# Altium schematic sheet FPGA.SchDoc
size A2; Date: Date; CompanyName: HESSO; Engineer: Name; Address1: Route du Rawyl 47; Address2: 1950 Sion; Address3: Switzerland; ProjectName: Project Name
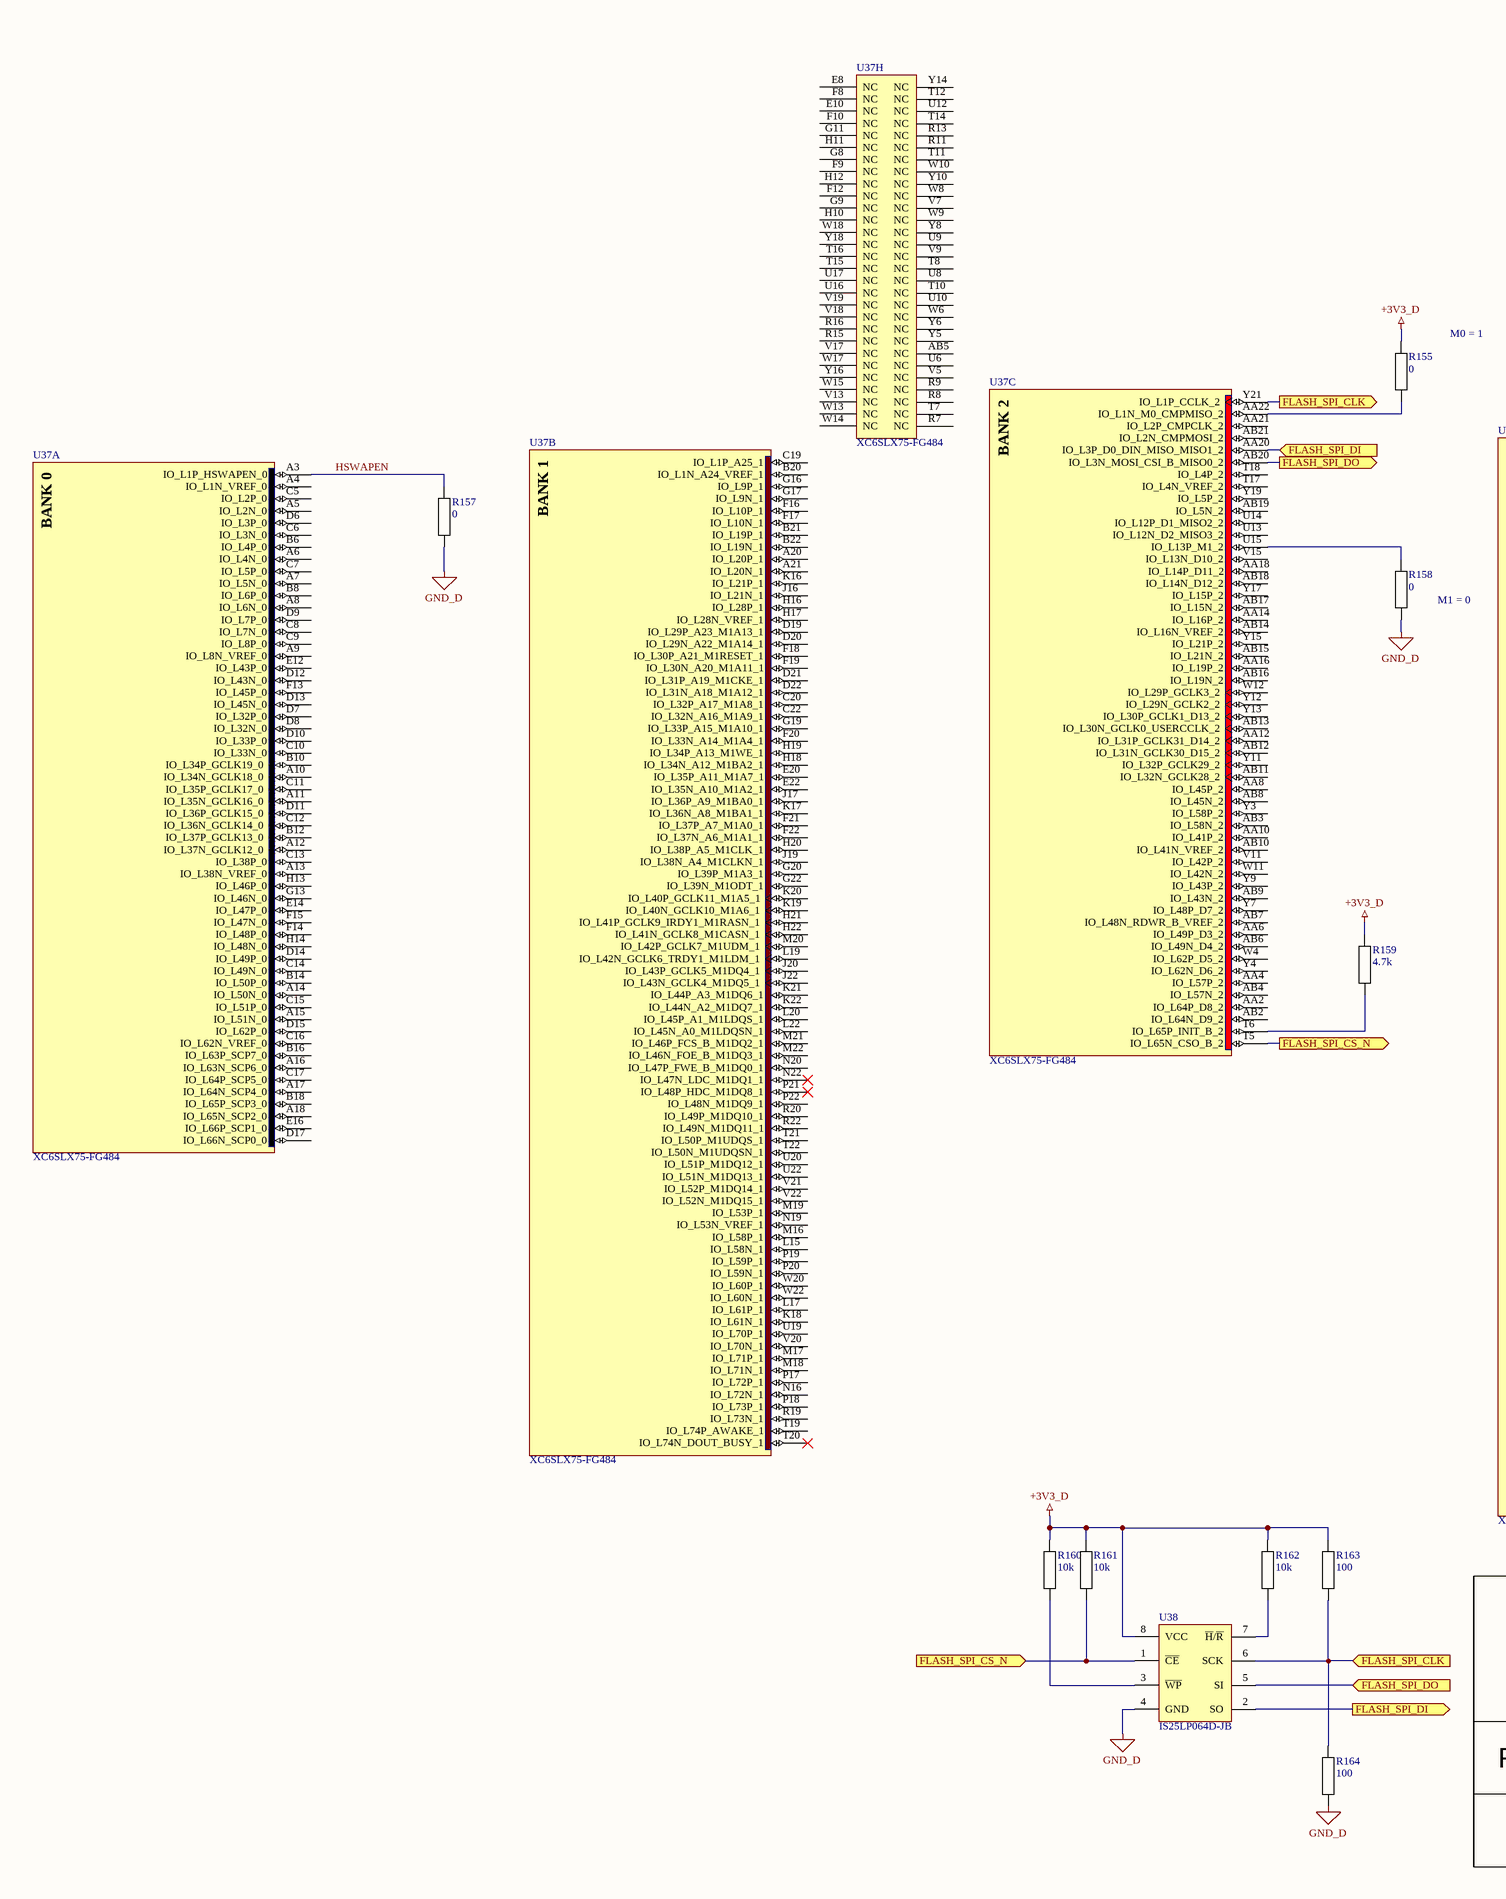
[diagram p0: FPGA.SchDoc, left]
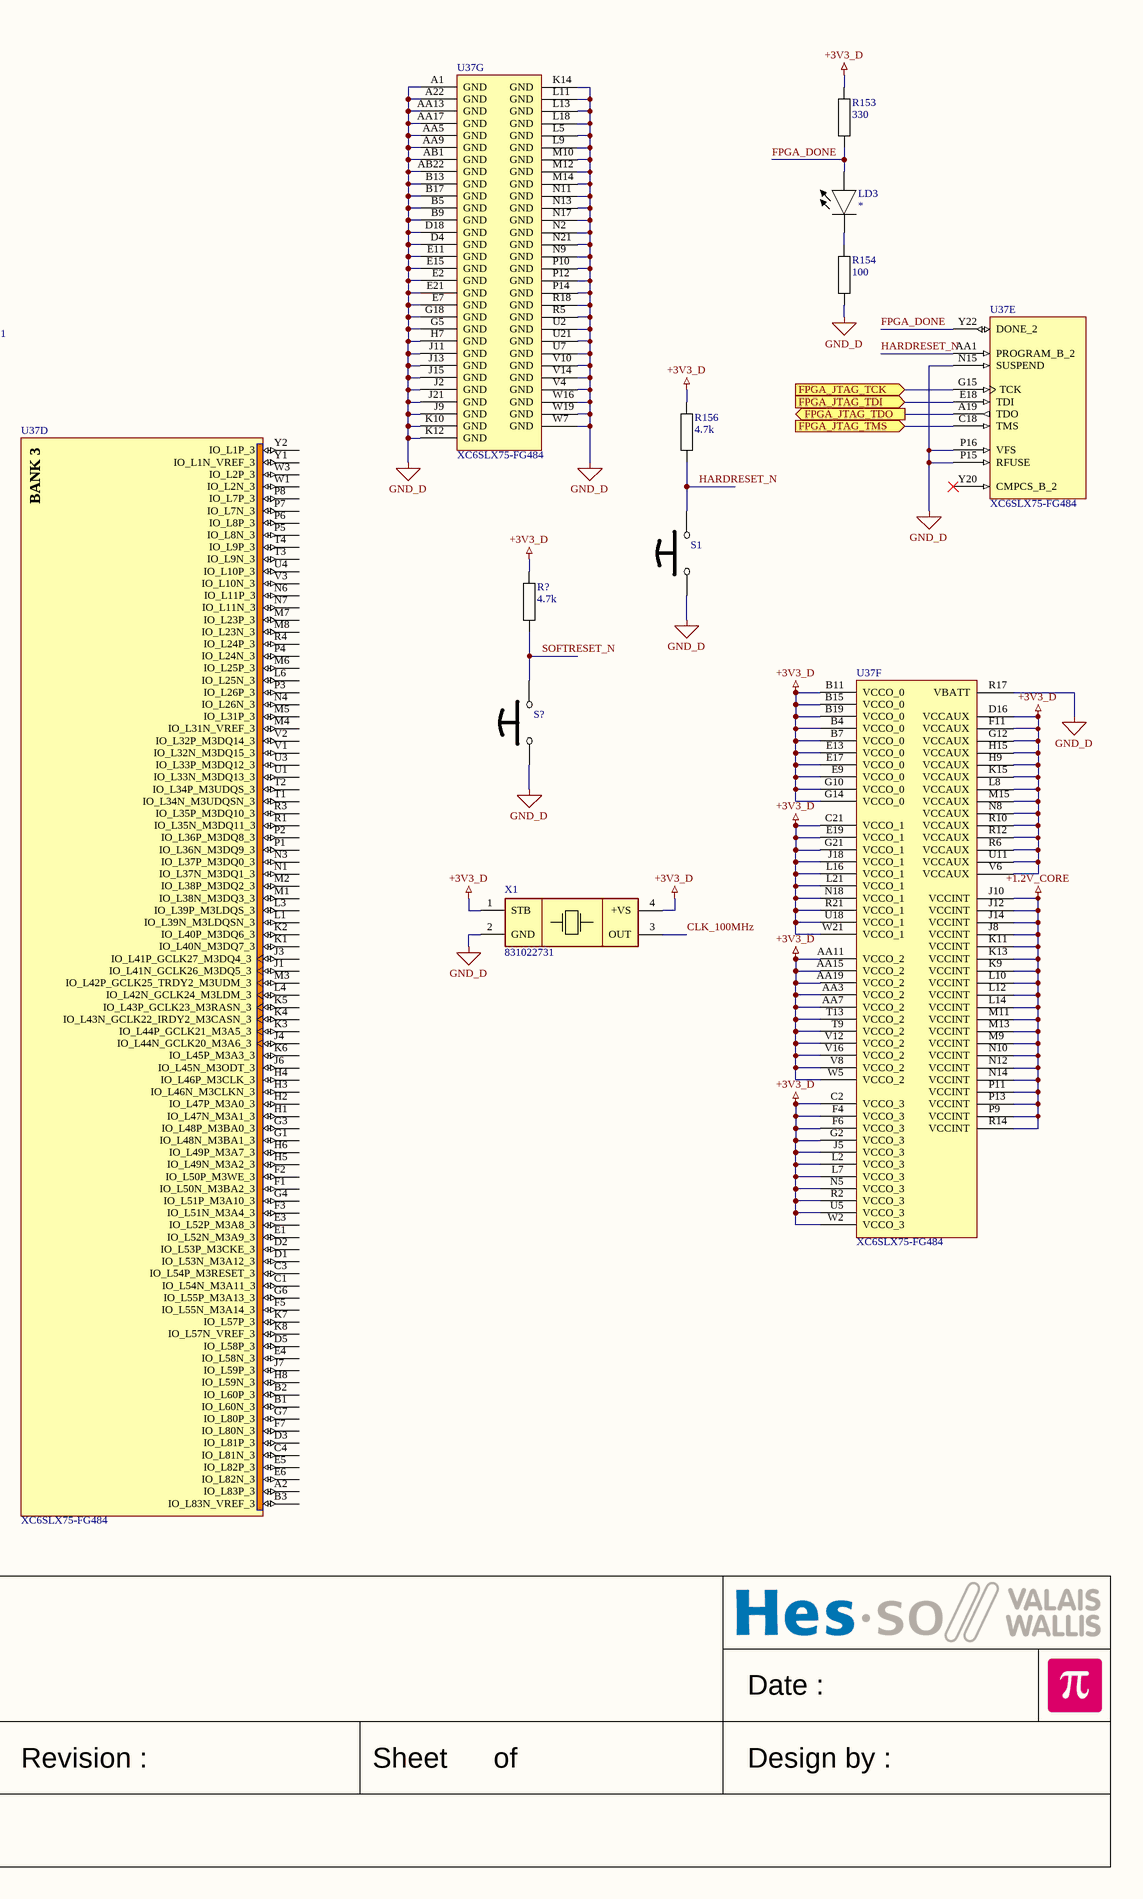
[diagram p1: FPGA.SchDoc, right]

## Parts
LD3  *  [LED 1608 REFLOW]
R153  330  [RESISTOR 2012 REFLOW]
R154  100  [RESISTOR 2012 REFLOW]
R155  0  [RESISTOR 2012 REFLOW]
R156  4.7k  [RESISTOR 2012 REFLOW]
R157  0  [RESISTOR 2012 REFLOW]
R158  0  [RESISTOR 2012 REFLOW]
R159  4.7k  [RESISTOR 2012 REFLOW]
R160  10k  [RESISTOR 1608 REFLOW]
R161  10k  [RESISTOR 1608 REFLOW]
R162  10k  [RESISTOR 1608 REFLOW]
R163  100  [RESISTOR 1608 REFLOW]
R164  100  [RESISTOR 1608 REFLOW]
R?  4.7k  [RESISTOR 2012 REFLOW]
S1  *  [Push Button C2.5X3.0 OMRON B3U-1000P(M)-B]  (value not drawn)
S?  *  [Push Button C2.5X3.0 OMRON B3U-1000P(M)-B]  (value not drawn)
U37  XC6SLX75-FG484  [BGA484 P1.0 C23X23 H2.2]  (parts A,B,C,D,E,F,G,H of 8)
U38  IS25LP064D-JB  [SO8 P1.27 C4.0X5.0 H1.75]
X1  831022731  [Oscillator C5.2x7.2 IQD LFSPXO]

## Ports
FLASH_SPI_CLK (in), FLASH_SPI_CLK (out), FLASH_SPI_CS_N (in), FLASH_SPI_CS_N (out), FLASH_SPI_DI (in), FLASH_SPI_DI (out), FLASH_SPI_DO (in), FLASH_SPI_DO (out), FPGA_JTAG_TCK (in), FPGA_JTAG_TDI (in), FPGA_JTAG_TDO (out), FPGA_JTAG_TMS (in)

## Nets
+1.2V_CORE: U37.J8(VCCINT) U37.J10(VCCINT) U37.J12(VCCINT) U37.J14(VCCINT) U37.K9(VCCINT) U37.K11(VCCINT) U37.K13(VCCINT) U37.L10(VCCINT) U37.L12(VCCINT) U37.L14(VCCINT) U37.M9(VCCINT) U37.M11(VCCINT) U37.M13(VCCINT) U37.N10(VCCINT) U37.N12(VCCINT) U37.N14(VCCINT) U37.P9(VCCINT) U37.P11(VCCINT) U37.P13(VCCINT) U37.R14(VCCINT)
+3V3_D: R153.2 R155.2 R156.2 R159.2 R160.2 R161.2 R162.2 R163.2 R?.2 U37.AA3(VCCO_2) U37.AA7(VCCO_2) U37.AA11(VCCO_2) U37.AA15(VCCO_2) U37.AA19(VCCO_2) U37.B4(VCCO_0) U37.B7(VCCO_0) U37.B11(VCCO_0) U37.B15(VCCO_0) U37.B19(VCCO_0) U37.C2(VCCO_3) U37.C21(VCCO_1) U37.D16(VCCAUX) U37.E9(VCCO_0) U37.E13(VCCO_0) U37.E17(VCCO_0) U37.E19(VCCO_1) U37.F4(VCCO_3) U37.F6(VCCO_3) U37.F11(VCCAUX) U37.G2(VCCO_3) U37.G10(VCCO_0) U37.G12(VCCAUX) U37.G14(VCCO_0) U37.G21(VCCO_1) U37.H9(VCCAUX) U37.H15(VCCAUX) U37.J5(VCCO_3) U37.J18(VCCO_1) U37.K15(VCCAUX) U37.L2(VCCO_3) U37.L7(VCCO_3) U37.L8(VCCAUX) U37.L16(VCCO_1) U37.L21(VCCO_1) U37.M15(VCCAUX) U37.N5(VCCO_3) U37.N8(VCCAUX) U37.N18(VCCO_1) U37.R2(VCCO_3) U37.R6(VCCAUX) U37.R10(VCCAUX) U37.R12(VCCAUX) U37.R21(VCCO_1) U37.T9(VCCO_2) U37.T13(VCCO_2) U37.U5(VCCO_3) U37.U11(VCCAUX) U37.U18(VCCO_1) U37.V6(VCCAUX) U37.V8(VCCO_2) U37.V12(VCCO_2) U37.V16(VCCO_2) U37.W2(VCCO_3) U37.W5(VCCO_2) U37.W21(VCCO_1) U38.8(VCC) X1.1(STB) X1.4(+VS)
GND_D: R154.1 R157.1 R158.1 R164.1 S1.1 S?.1 U37.A1(GND) U37.A22(GND) U37.AA5(GND) U37.AA9(GND) U37.AA13(GND) U37.AA17(GND) U37.AB1(GND) U37.AB22(GND) U37.B5(GND) U37.B9(GND) U37.B13(GND) U37.B17(GND) U37.D4(GND) U37.D18(GND) U37.E2(GND) U37.E7(GND) U37.E11(GND) U37.E15(GND) U37.E21(GND) U37.G5(GND) U37.G18(GND) U37.H7(GND) U37.J2(GND) U37.J9(GND) U37.J11(GND) U37.J13(GND) U37.J15(GND) U37.J21(GND) U37.K10(GND) U37.K12(GND) U37.K14(GND) U37.L5(GND) U37.L9(GND) U37.L11(GND) U37.L13(GND) U37.L18(GND) U37.M10(GND) U37.M12(GND) U37.M14(GND) U37.N2(GND) U37.N9(GND) U37.N11(GND) U37.N13(GND) U37.N15(SUSPEND) U37.N17(GND) U37.N21(GND) U37.P10(GND) U37.P12(GND) U37.P14(GND) U37.P15(RFUSE) U37.P16(VFS) U37.R5(GND) U37.R17(VBATT) U37.R18(GND) U37.U2(GND) U37.U7(GND) U37.U21(GND) U37.V4(GND) U37.V10(GND) U37.V14(GND) U37.W7(GND) U37.W16(GND) U37.W19(GND) U38.4(GND) X1.2(GND)
CLK_100MHz: X1.3(OUT)
FLASH_SPI_CLK: R163.1 R164.2 U37.Y21(IO_L1P_CCLK_2) U38.6(SCK) ; port FLASH_SPI_CLK
FLASH_SPI_CS_N: R161.1 U37.T5(IO_L65N_CSO_B_2) U38.1(~{CE}) ; port FLASH_SPI_CS_N
FLASH_SPI_DI: U37.AA20(IO_L3P_D0_DIN_MISO_MISO1_2) U38.2(SO) ; port FLASH_SPI_DI
FLASH_SPI_DO: U37.AB20(IO_L3N_MOSI_CSI_B_MISO0_2) U38.5(SI) ; port FLASH_SPI_DO
FPGA_DONE: LD3.2(A) R153.1 U37.Y22(DONE_2)
FPGA_JTAG_TCK: U37.G15(TCK) ; port FPGA_JTAG_TCK
FPGA_JTAG_TDI: U37.E18(TDI) ; port FPGA_JTAG_TDI
FPGA_JTAG_TDO: U37.A19(TDO) ; port FPGA_JTAG_TDO
FPGA_JTAG_TMS: U37.C18(TMS) ; port FPGA_JTAG_TMS
HARDRESET_N: R156.1 S1.2 U37.AA1(PROGRAM_B_2)
HSWAPEN: R157.2 U37.A3(IO_L1P_HSWAPEN_0)
SOFTRESET_N: R?.1 S?.2
NetLD3_1: LD3.1(C) R154.2
NetR155_1: R155.1 U37.AA22(IO_L1N_M0_CMPMISO_2)
NetR158_2: R158.2 U37.U15(IO_L13P_M1_2)
NetR159_1: R159.1 U37.T6(IO_L65P_INIT_B_2)
NetR160_1: R160.1 U38.3(~{WP})
NetR162_1: R162.1 U38.7(~{H}/~{R})

Not connected (* = marked no-connect by the designer): U37 A2(IO_L83P_3) A4(IO_L1N_VREF_0) A5(IO_L2N_0) A6(IO_L4N_0) A7(IO_L5N_0) A8(IO_L6N_0) A9(IO_L8N_VREF_0) A10(IO_L34N_GCLK18_0) A11(IO_L35N_GCLK16_0) A12(IO_L37N_GCLK12_0) A13(IO_L38N_VREF_0) A14(IO_L50N_0) A15(IO_L51N_0) A16(IO_L63N_SCP6_0) A17(IO_L64N_SCP4_0) A18(IO_L65N_SCP2_0) A20(IO_L20P_1) A21(IO_L20N_1) AA2(IO_L64P_D8_2) AA4(IO_L57P_2) AA6(IO_L49P_D3_2) AA8(IO_L45P_2) AA10(IO_L41P_2) AA12(IO_L31P_GCLK31_D14_2) AA14(IO_L16P_2) AA16(IO_L19P_2) AA18(IO_L14P_D11_2) AA21(IO_L2P_CMPCLK_2) AB2(IO_L64N_D9_2) AB3(IO_L58N_2) AB4(IO_L57N_2) AB5(NC) AB6(IO_L49N_D4_2) AB7(IO_L48N_RDWR_B_VREF_2) AB8(IO_L45N_2) AB9(IO_L43N_2) AB10(IO_L41N_VREF_2) AB11(IO_L32N_GCLK28_2) AB12(IO_L31N_GCLK30_D15_2) AB13(IO_L30N_GCLK0_USERCCLK_2) AB14(IO_L16N_VREF_2) AB15(IO_L21N_2) AB16(IO_L19N_2) AB17(IO_L15N_2) AB18(IO_L14N_D12_2) AB19(IO_L5N_2) AB21(IO_L2N_CMPMOSI_2) B1(IO_L60N_3) B2(IO_L60P_3) B3(IO_L83N_VREF_3) B6(IO_L4P_0) B8(IO_L6P_0) B10(IO_L34P_GCLK19_0) B12(IO_L37P_GCLK13_0) B14(IO_L50P_0) B16(IO_L63P_SCP7_0) B18(IO_L65P_SCP3_0) B20(IO_L1N_A24_VREF_1) B21(IO_L19P_1) B22(IO_L19N_1) C1(IO_L54N_M3A11_3) C3(IO_L54P_M3RESET_3) C4(IO_L81N_3) C5(IO_L2P_0) C6(IO_L3N_0) C7(IO_L5P_0) C8(IO_L7N_0) C9(IO_L8P_0) C10(IO_L33N_0) C11(IO_L35P_GCLK17_0) C12(IO_L36N_GCLK14_0) C13(IO_L38P_0) C14(IO_L49N_0) C15(IO_L51P_0) C16(IO_L62N_VREF_0) C17(IO_L64P_SCP5_0) C19(IO_L1P_A25_1) C20(IO_L32P_A17_M1A8_1) C22(IO_L32N_A16_M1A9_1) D1(IO_L53N_M3A12_3) D2(IO_L53P_M3CKE_3) D3(IO_L81P_3) D5(IO_L58P_3) D6(IO_L3P_0) D7(IO_L32P_0) D8(IO_L32N_0) D9(IO_L7P_0) D10(IO_L33P_0) D11(IO_L36P_GCLK15_0) D12(IO_L43N_0) D13(IO_L45N_0) D14(IO_L49P_0) D15(IO_L62P_0) D17(IO_L66N_SCP0_0) D19(IO_L29P_A23_M1A13_1) D20(IO_L29N_A22_M1A14_1) D21(IO_L31P_A19_M1CKE_1) D22(IO_L31N_A18_M1A12_1) E1(IO_L52N_M3A9_3) E3(IO_L52P_M3A8_3) E4(IO_L58N_3) E5(IO_L82P_3) E6(IO_L82N_3) E8(NC) E10(NC) E12(IO_L43P_0) E14(IO_L47P_0) E16(IO_L66P_SCP1_0) E20(IO_L35P_A11_M1A7_1) E22(IO_L35N_A10_M1A2_1) F1(IO_L50N_M3BA2_3) F2(IO_L50P_M3WE_3) F3(IO_L51N_M3A4_3) F5(IO_L55N_M3A14_3) F7(IO_L80N_3) F8(NC) F9(NC) F10(NC) F12(NC) F13(IO_L45P_0) F14(IO_L48P_0) F15(IO_L47N_0) F16(IO_L10P_1) F17(IO_L10N_1) F18(IO_L30P_A21_M1RESET_1) F19(IO_L30N_A20_M1A11_1) F20(IO_L33N_A14_M1A4_1) F21(IO_L37P_A7_M1A0_1) F22(IO_L37N_A6_M1A1_1) G1(IO_L48N_M3BA1_3) G3(IO_L48P_M3BA0_3) G4(IO_L51P_M3A10_3) G6(IO_L55P_M3A13_3) G7(IO_L80P_3) G8(NC) G9(NC) G11(NC) G13(IO_L46N_0) G16(IO_L9P_1) G17(IO_L9N_1) G19(IO_L33P_A15_M1A10_1) G20(IO_L39P_M1A3_1) G22(IO_L39N_M1ODT_1) H1(IO_L47N_M3A1_3) H2(IO_L47P_M3A0_3) H3(IO_L46N_M3CLKN_3) H4(IO_L46P_M3CLK_3) H5(IO_L49N_M3A2_3) H6(IO_L49P_M3A7_3) H8(IO_L59N_3) H10(NC) H11(NC) H12(NC) H13(IO_L46P_0) H14(IO_L48N_0) H16(IO_L28P_1) H17(IO_L28N_VREF_1) H18(IO_L34N_A12_M1BA2_1) H19(IO_L34P_A13_M1WE_1) H20(IO_L38P_A5_M1CLK_1) H21(IO_L41P_GCLK9_IRDY1_M1RASN_1) H22(IO_L41N_GCLK8_M1CASN_1) J1(IO_L41N_GCLK26_M3DQ5_3) J3(IO_L41P_GCLK27_M3DQ4_3) J4(IO_L44N_GCLK20_M3A6_3) J6(IO_L45N_M3ODT_3) J7(IO_L59P_3) J16(IO_L21N_1) J17(IO_L36P_A9_M1BA0_1) J19(IO_L38N_A4_M1CLKN_1) J20(IO_L43P_GCLK5_M1DQ4_1) J22(IO_L43N_GCLK4_M1DQ5_1) K1(IO_L40N_M3DQ7_3) K2(IO_L40P_M3DQ6_3) K3(IO_L44P_GCLK21_M3A5_3) K4(IO_L43N_GCLK22_IRDY2_M3CASN_3) K5(IO_L43P_GCLK23_M3RASN_3) K6(IO_L45P_M3A3_3) K7(IO_L57P_3) K8(IO_L57N_VREF_3) K16(IO_L21P_1) K17(IO_L36N_A8_M1BA1_1) K18(IO_L61N_1) K19(IO_L40N_GCLK10_M1A6_1) K20(IO_L40P_GCLK11_M1A5_1) K21(IO_L44P_A3_M1DQ6_1) K22(IO_L44N_A2_M1DQ7_1) L1(IO_L39N_M3LDQSN_3) L3(IO_L39P_M3LDQS_3) L4(IO_L42N_GCLK24_M3LDM_3) L6(IO_L25N_3) L15(IO_L58N_1) L17(IO_L61P_1) L19(IO_L42N_GCLK6_TRDY1_M1LDM_1) L20(IO_L45P_A1_M1LDQS_1) L22(IO_L45N_A0_M1LDQSN_1) M1(IO_L38N_M3DQ3_3) M2(IO_L38P_M3DQ2_3) M3(IO_L42P_GCLK25_TRDY2_M3UDM_3) M4(IO_L31N_VREF_3) M5(IO_L31P_3) M6(IO_L25P_3) M7(IO_L23P_3) M8(IO_L23N_3) M16(IO_L58P_1) M17(IO_L71P_1) M18(IO_L71N_1) M19(IO_L53P_1) M20(IO_L42P_GCLK7_M1UDM_1) M21(IO_L46P_FCS_B_M1DQ2_1) M22(IO_L46N_FOE_B_M1DQ3_1) N1(IO_L37N_M3DQ1_3) N3(IO_L37P_M3DQ0_3) N4(IO_L26N_3) N6(IO_L11P_3) N7(IO_L11N_3) N16(IO_L72N_1) N19(IO_L53N_VREF_1) N20(IO_L47P_FWE_B_M1DQ0_1) N22(IO_L47N_LDC_M1DQ1_1)* P1(IO_L36N_M3DQ9_3) P2(IO_L36P_M3DQ8_3) P3(IO_L26P_3) P4(IO_L24N_3) P5(IO_L8N_3) P6(IO_L8P_3) P7(IO_L7N_3) P8(IO_L7P_3) P17(IO_L72P_1) P18(IO_L73P_1) P19(IO_L59P_1) P20(IO_L59N_1) P21(IO_L48P_HDC_M1DQ8_1)* P22(IO_L48N_M1DQ9_1) R1(IO_L35N_M3DQ11_3) R3(IO_L35P_M3DQ10_3) R4(IO_L24P_3) R7(NC) R8(NC) R9(NC) R11(NC) R13(NC) R15(NC) R16(NC) R19(IO_L73N_1) R20(IO_L49P_M1DQ10_1) R22(IO_L49N_M1DQ11_1) T1(IO_L34N_M3UDQSN_3) T2(IO_L34P_M3UDQS_3) T3(IO_L9N_3) T4(IO_L9P_3) T7(NC) T8(NC) T10(NC) T11(NC) T12(NC) T14(NC) T15(NC) T16(NC) T17(IO_L4N_VREF_2) T18(IO_L4P_2) T19(IO_L74P_AWAKE_1) T20(IO_L74N_DOUT_BUSY_1)* T21(IO_L50P_M1UDQS_1) T22(IO_L50N_M1UDQSN_1) U1(IO_L33N_M3DQ13_3) U3(IO_L33P_M3DQ12_3) U4(IO_L10P_3) U6(NC) U8(NC) U9(NC) U10(NC) U12(NC) U13(IO_L12N_D2_MISO3_2) U14(IO_L12P_D1_MISO2_2) U16(NC) U17(NC) U19(IO_L70P_1) U20(IO_L51P_M1DQ12_1) U22(IO_L51N_M1DQ13_1) V1(IO_L32N_M3DQ15_3) V2(IO_L32P_M3DQ14_3) V3(IO_L10N_3) V5(NC) V7(NC) V9(NC) V11(IO_L42P_2) V13(NC) V15(IO_L13N_D10_2) V17(NC) V18(NC) V19(NC) V20(IO_L70N_1) V21(IO_L52P_M1DQ14_1) V22(IO_L52N_M1DQ15_1) W1(IO_L2N_3) W3(IO_L2P_3) W4(IO_L62P_D5_2) W6(NC) W8(NC) W9(NC) W10(NC) W11(IO_L42N_2) W12(IO_L29P_GCLK3_2) W13(NC) W14(NC) W15(NC) W17(NC) W18(NC) W20(IO_L60P_1) W22(IO_L60N_1) Y1(IO_L1N_VREF_3) Y2(IO_L1P_3) Y3(IO_L58P_2) Y4(IO_L62N_D6_2) Y5(NC) Y6(NC) Y7(IO_L48P_D7_2) Y8(NC) Y9(IO_L43P_2) Y10(NC) Y11(IO_L32P_GCLK29_2) Y12(IO_L29N_GCLK2_2) Y13(IO_L30P_GCLK1_D13_2) Y14(NC) Y15(IO_L21P_2) Y16(NC) Y17(IO_L15P_2) Y18(NC) Y19(IO_L5P_2) Y20(CMPCS_B_2)*

## Notes on the sheet
- M0 = 1
- (near R158) M1 = 0
- Date :
- Revision :
- Sheet
- of
- Design by :
- (in symbol XC6SLX75-FG484, part A) BANK 0
- (in symbol XC6SLX75-FG484, part B) BANK 1
- (in symbol XC6SLX75-FG484, part C) BANK 2
- (in symbol XC6SLX75-FG484, part D) BANK 3

## Library data of the parts
LD3 = LED: LED generic; Value: *
R153-R159 R? = Resistor: Resistor 1% 50V 125mW 2012(0805)
  R153: Value: 330
  R154: Value: 100
  R155 R157 R158: Value: 0
  R156 R159 R?: Value: 4.7k
R160-R164 = Resistor: Resistor 1% 50V 100mW 1608(0603)
  R160-R162: Value: 10k
  R163 R164: Value: 100
S1 S? = Push Button 2Pins: Push Button, 2 pins; Value: *
U37 = XC6SLX75-FG484: Spartan-6 LXT 1.2V FPGA, 268 User I/Os, 484-Ball Fine-Pitch BGA (1.0mm Pitch); Value: XC6SLX75-FG484
U38 = IS25LP064D-JB: 64Mb Serial Flash Memory; Value: IS25LP064D-JB
X1 = Oscillator C5.2x7.2 IQD LFSPXO: Value: 831022731; MouserNumber: 710-831022731